# Altium project Modulers-RTC.PrjPcb
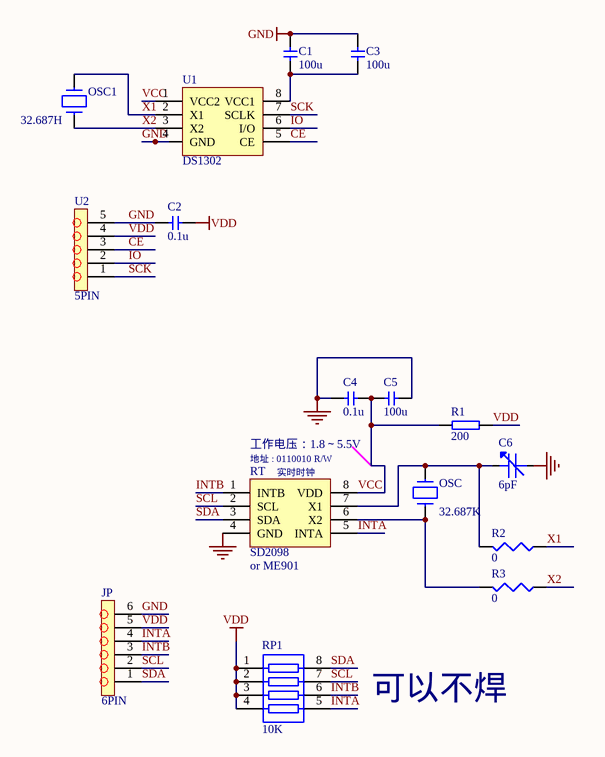
[diagram p0: DS1302_SD2098.SchDoc]
1 sheet, 16 parts. Net scope: global (net labels, ports and power ports of the same name join across sheets).
Board file: DS1302_SD2098.PcbDoc

## Sheet DS1302_SD2098.SchDoc
size A

### Parts
C1  100u  [RC100]
C2  0.1u  [RC100]
C3  100u  [RC100]
C4  0.1u  [RC100]
C5  100u  [RC100]
C6  6pF  [RC100]
JP  6PIN  [SIP6]
OSC  32.687K  [OSC200]
OSC1  32.687H  [OSC100]
R1  200  [0805]
R2  0  [0805]
R3  0  [0805]
RP1  10K  [RN4]
RT  SD2098  [SOP-8_212]
U1  DS1302  [SO-8-197]
U2  5PIN  [SIP5]

### Nets
GND: C1.1 C2.1 C3.1 C4.1 C5.2 C6.2 JP.6 RT.4(GND) U1.4(GND) U2.5
VDD: C2.2 JP.5 R1.2 RP1.1 RP1.2 RP1.3 RP1.4 U2.4
CE: U1.5(CE) U2.3
INTA: JP.4 RP1.5 RT.5(INTA)
INTB: JP.3 RP1.6 RT.1(INTB)
IO: U1.6(I/O) U2.2
SCK: U1.7(SCLK) U2.1
SCL: JP.2 RP1.7 RT.2(SCL)
SDA: JP.1 RP1.8 RT.3(SDA)
VCC: C4.2 C5.1 R1.1 RT.8(VDD) U1.1(VCC2)
X1: OSC1.2 R2.1 U1.2(X1)
X2: OSC1.1 R3.1 U1.3(X2)
NetC1_2: C1.2 C3.2 U1.8(VCC1)
NetC6_1: C6.1 OSC.2 R2.2 RT.7(X1)
NetOSC_1: OSC.1 R3.2 RT.6(X2)

### Notes on the sheet
- (near RT) 地址 : 0110010 R/W
- 工作电压：1.8～5.5V
- (near RT) 实时时钟
- (near RT) or ME901
- 可以不焊

### Library data of the parts
C1-C5 = CAPA
C6 = CAPVAR
OSC OSC1 = CRYSTAL
R1 = RES2A
R2 R3 = RES2B
RP1 = RESPACK4